# EAGLE schematic classicVtwin (EAGLE 6.3)
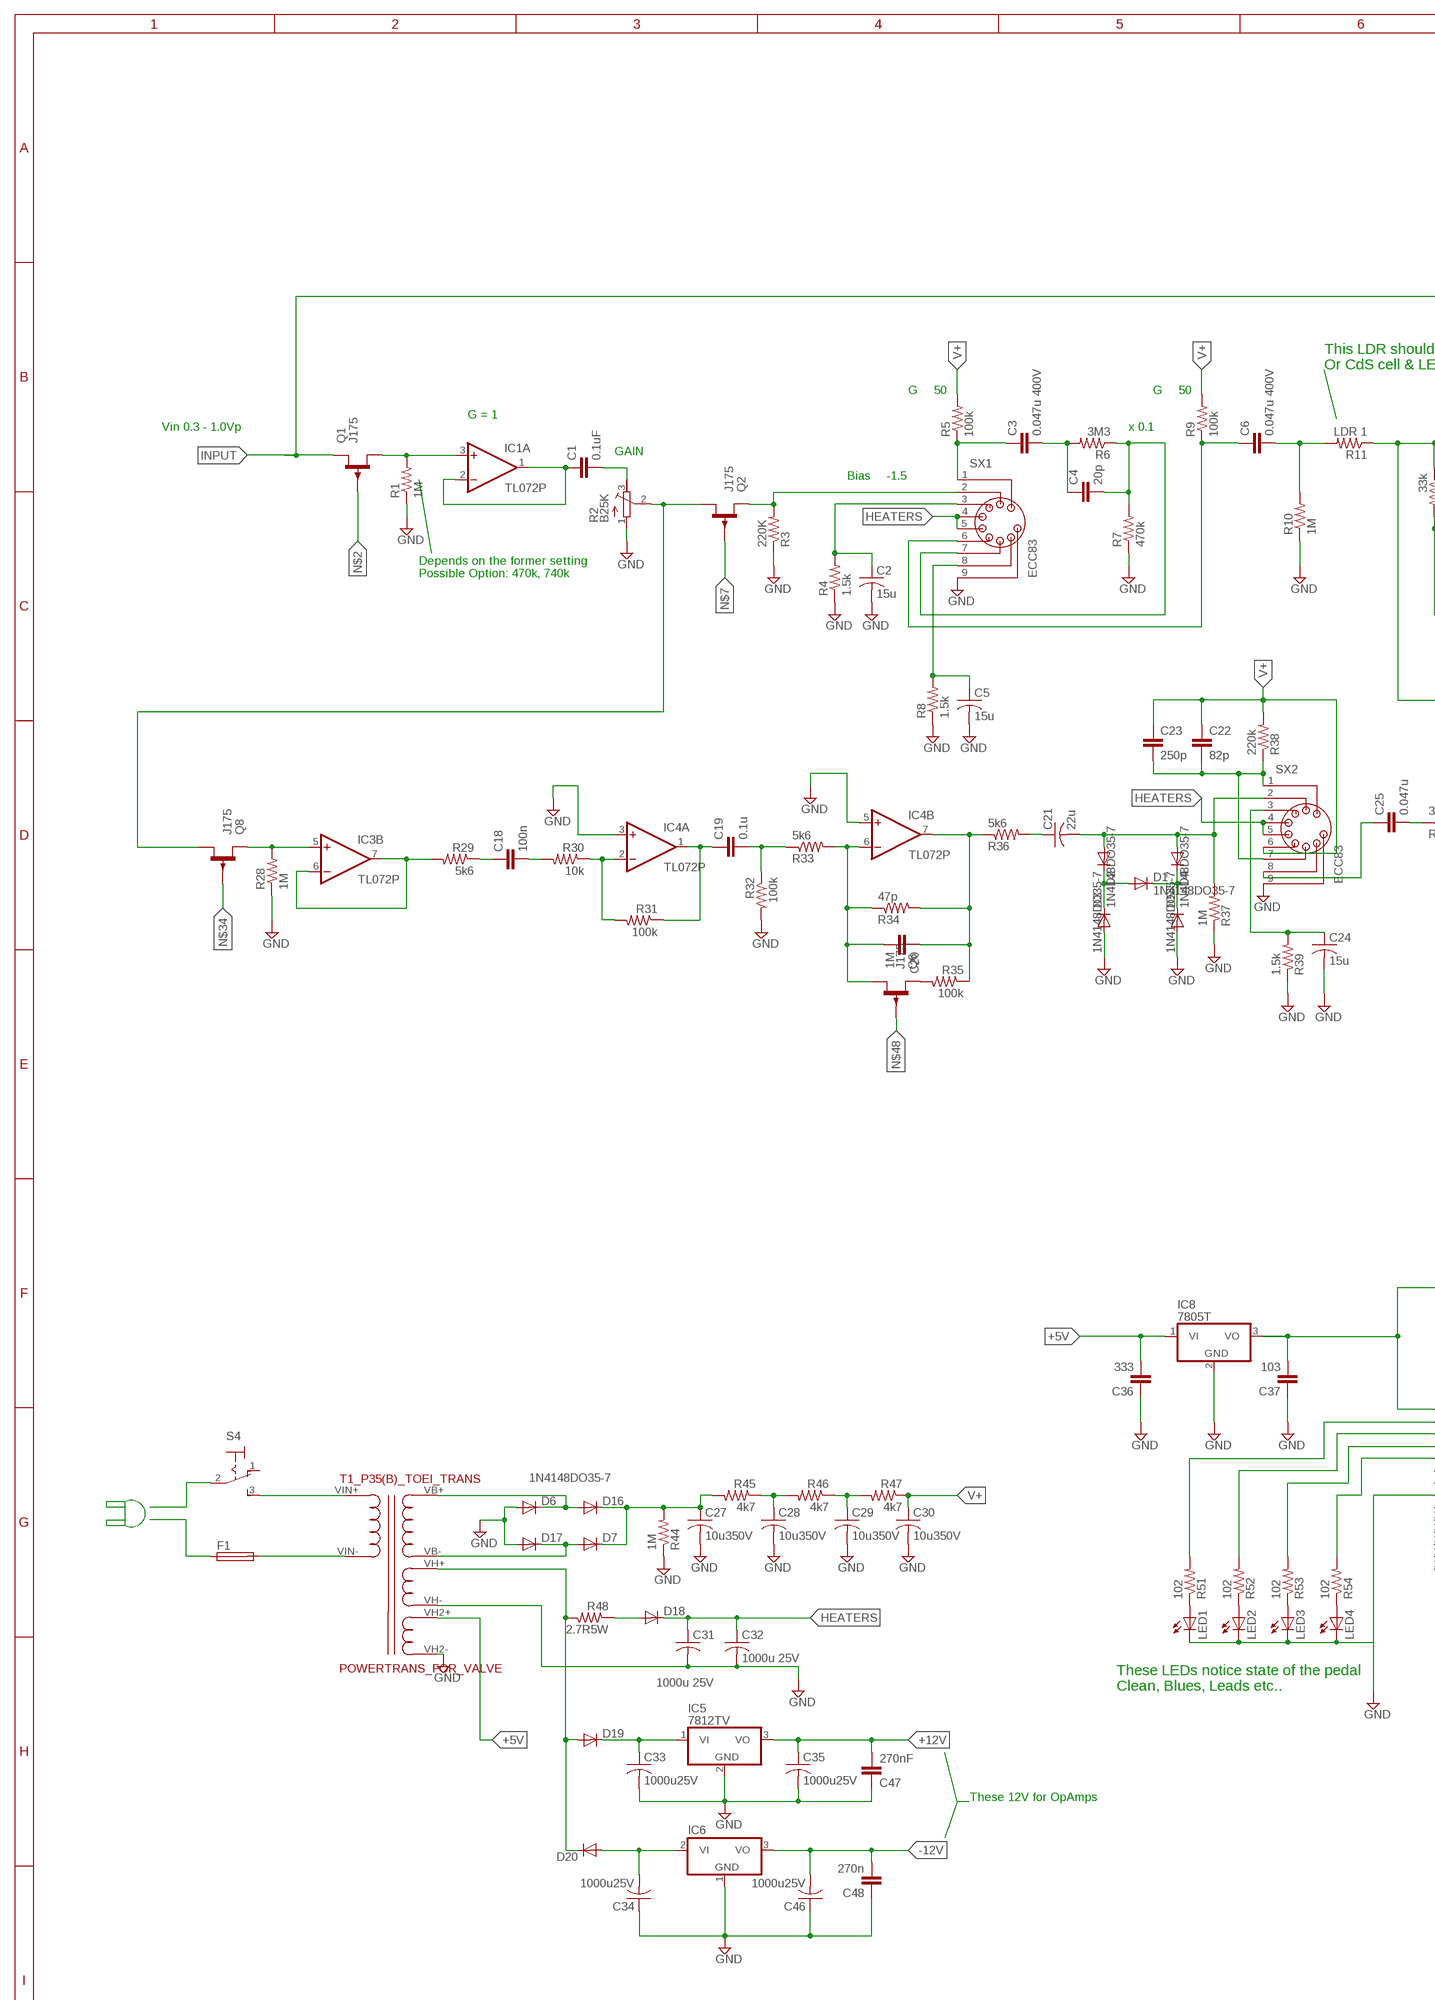
[diagram p0: schematic, sheet 1, part 1 of 2]
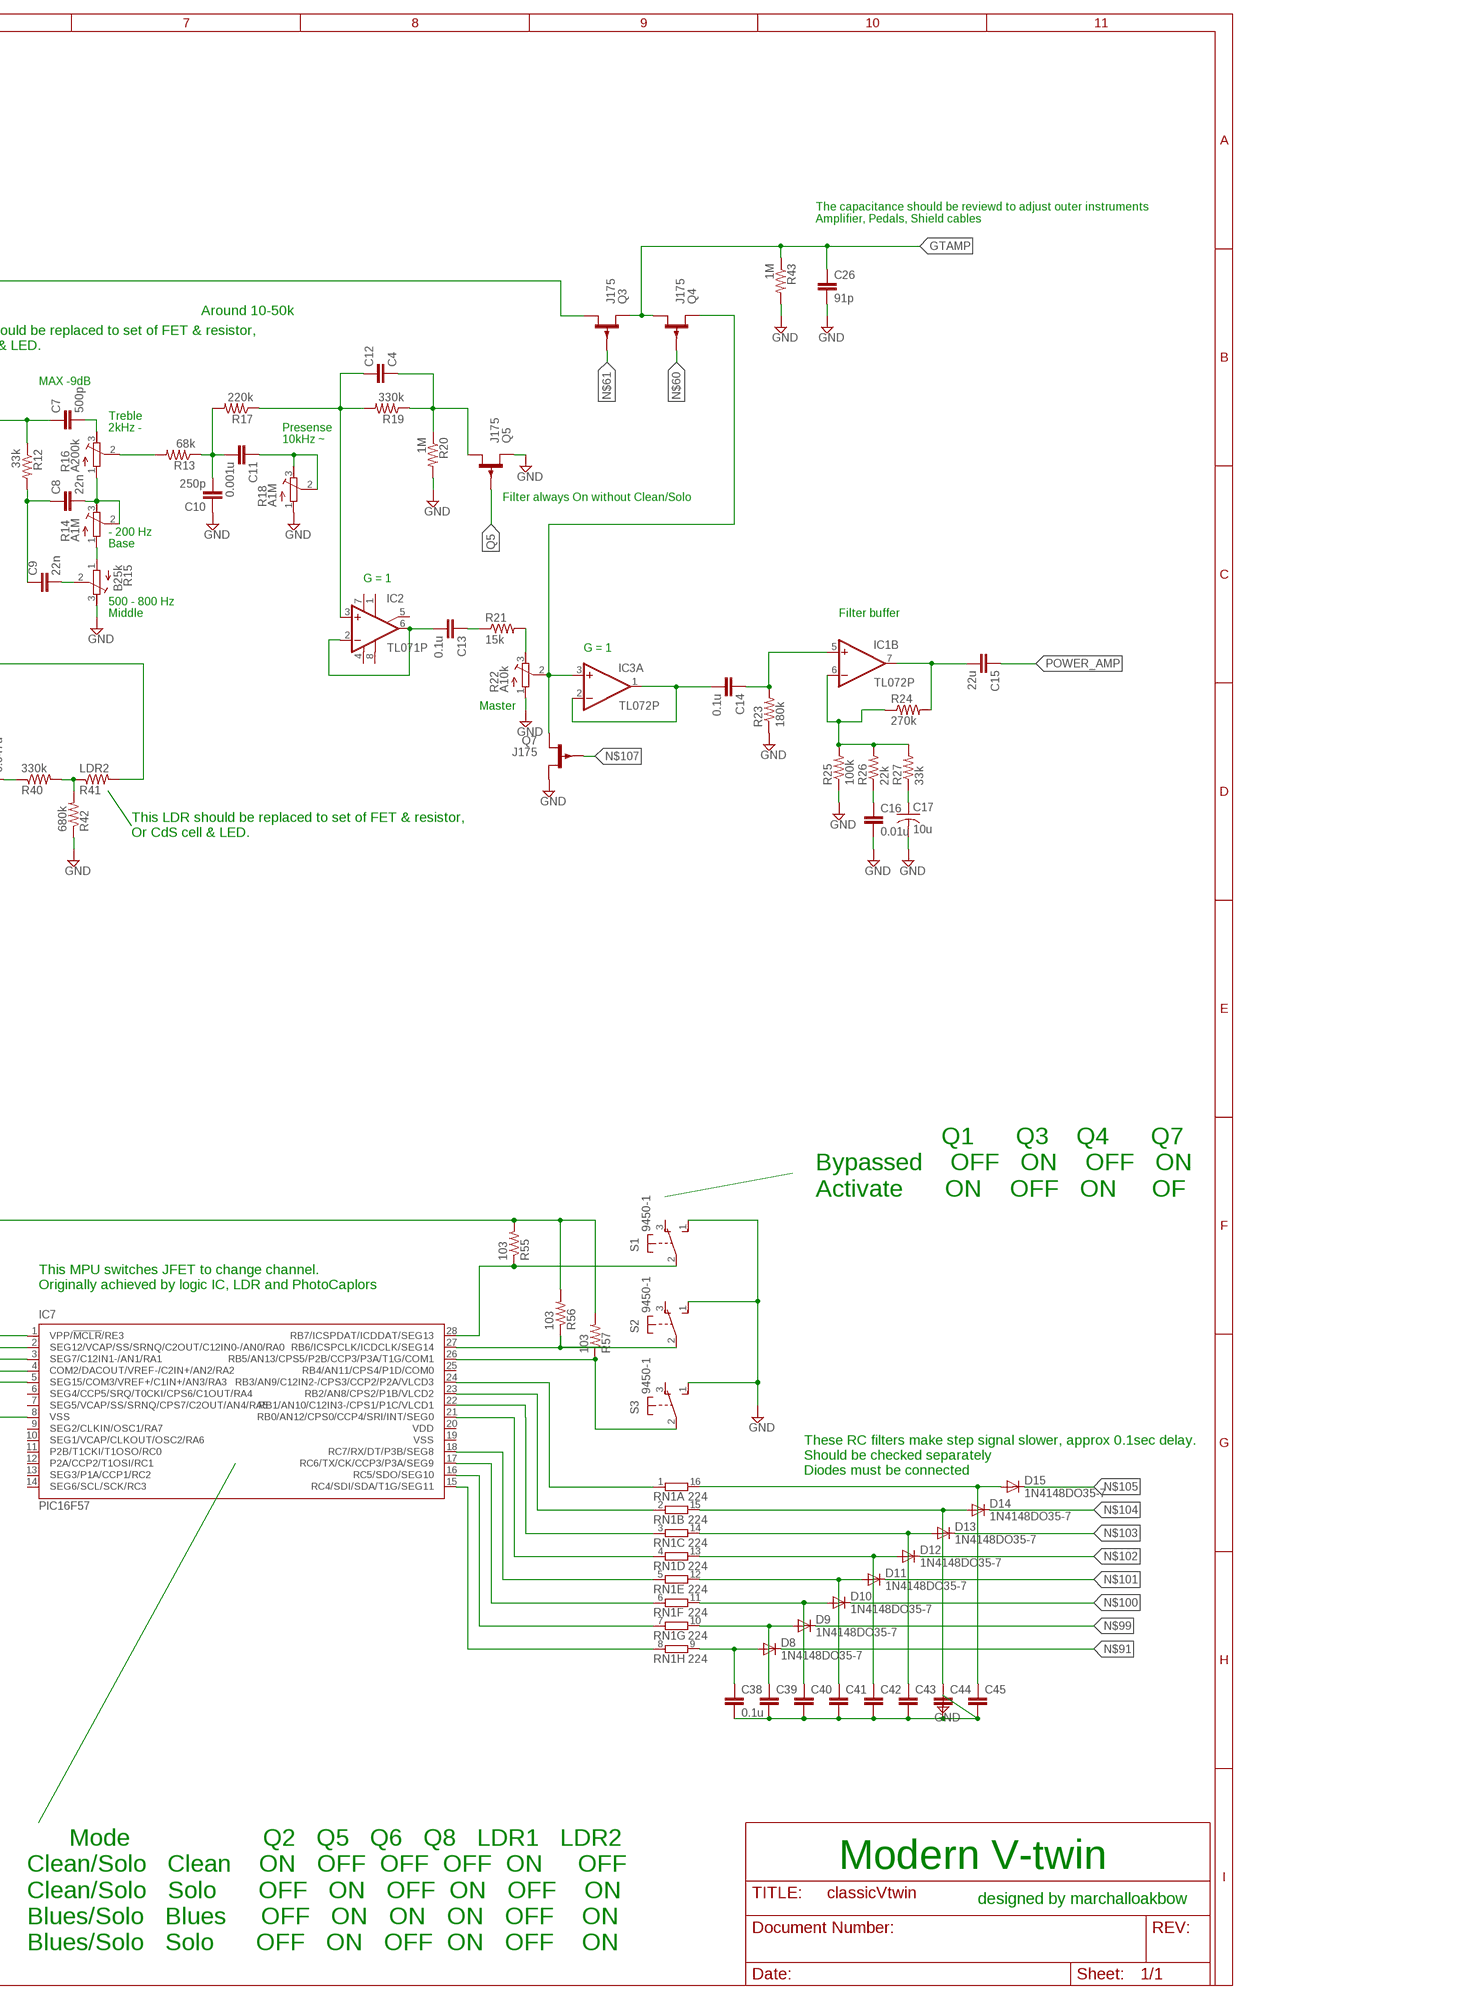
[diagram p1: schematic, sheet 1, part 2 of 2]

## Parts
C1  0.1uF  C5/3  [C5B3]
C2  15u  C-US025-025X050  [C025-025X050]
C3  0.047u 400V  C5/3  [C5B3]
C4  20p  C5/3  [C5B3]
C5  15u  C-US025-025X050  [C025-025X050]
C6  0.047u 400V  C5/3  [C5B3]
C7  500p  C5/3  [C5B3]
C8  22n  C5/3  [C5B3]
C9  22n  C5/3  [C5B3]
C10  250p  C5/3  [C5B3]
C11  0.001u  C5/3  [C5B3]
C12  C4  C5/3  [C5B3]
C13  0.1u  C5/3  [C5B3]
C14  0.1u  C5/3  [C5B3]
C15  22u  C5/3  [C5B3]
C16  0.01u  C5/3  [C5B3]
C17  10u  C-US025-025X050  [C025-025X050]
C18  100n  C5/3  [C5B3]
C19  0.1u  C5/3  [C5B3]
C20  1M  C5/3  [C5B3]
C21  22u  C-US025-025X050  [C025-025X050]
C22  82p  C5/3  [C5B3]
C23  250p  C5/3  [C5B3]
C24  15u  C-US025-025X050  [C025-025X050]
C25  0.047u  C5/3  [C5B3]
C26  91p  C5/3  [C5B3]
C27  10u350V  C-US025-025X050  [C025-025X050]
C28  10u350V  C-US025-025X050  [C025-025X050]
C29  10u350V  C-US025-025X050  [C025-025X050]
C30  10u350V  C-US025-025X050  [C025-025X050]
C31  1000u 25V  C-US025-025X050  [C025-025X050]
C32  1000u 25V  C-US025-025X050  [C025-025X050]
C33  1000u25V  C-US025-025X050  [C025-025X050]
C34  1000u25V  C-US025-025X050  [C025-025X050]
C35  1000u25V  C-US025-025X050  [C025-025X050]
C36  333  C5/3  [C5B3]
C37  103  C5/3  [C5B3]
C38  0.1u  C-EU025-024X044  [C025-024X044]
C39  C-EU025-024X044  [C025-024X044]
C40  C-EU025-024X044  [C025-024X044]
C41  C-EU025-024X044  [C025-024X044]
C42  C-EU025-024X044  [C025-024X044]
C43  C-EU025-024X044  [C025-024X044]
C44  C-EU025-024X044  [C025-024X044]
C45  C-EU025-024X044  [C025-024X044]
C46  1000u25V  C-US025-025X050  [C025-025X050]
C47  270nF  C5/3  [C5B3]
C48  270n  C5/3  [C5B3]
D1  1N4148DO35-7  [DO35-7]
D2  1N4148DO35-7  [DO35-7]
D3  1N4148DO35-7  [DO35-7]
D4  1N4148DO35-7  [DO35-7]
D5  1N4148DO35-7  [DO35-7]
D6  1N4148DO35-7  [DO35-7]
D7  1N4148DO35-7  [DO35-7]
D8  1N4148DO35-7  [DO35-7]
D9  1N4148DO35-7  [DO35-7]
D10  1N4148DO35-7  [DO35-7]
D11  1N4148DO35-7  [DO35-7]
D12  1N4148DO35-7  [DO35-7]
D13  1N4148DO35-7  [DO35-7]
D14  1N4148DO35-7  [DO35-7]
D15  1N4148DO35-7  [DO35-7]
D16  1N4148DO35-7  [DO35-7]
D17  1N4148DO35-7  [DO35-7]
D18  1N4148DO35-7  [DO35-7]
D19  1N4148DO35-7  [DO35-7]
D20  1N4148DO35-7  [DO35-7]
F1  SH22,5  [SH22,5]
IC1  TL072P  [DIL08]
IC2  TL071P  [DIL08]
IC3  TL072P  [DIL08]
IC4  TL072P  [DIL08]
IC5  7812TV  [TO220V]
IC6  7912T  [TO220H]
IC7  PIC16F57  PIC16F1933SP  [DIL28-3]
IC8  7805T  [TO220H]
LED1  LED5MM  [LED5MM]
LED2  LED5MM  [LED5MM]
LED3  LED5MM  [LED5MM]
LED4  LED5MM  [LED5MM]
Q1  J175  2N3820  [TO92F]
Q2  J175  2N3820  [TO92F]
Q3  J175  2N3820  [TO92F]
Q4  J175  2N3820  [TO92F]
Q5  J175  2N3820  [TO92F]
Q6  J175  2N3820  [TO92F]
Q7  J175  2N3820  [TO92F]
Q8  J175  2N3820  [TO92F]
R1  1M  R-US_0204/2V  [0204V]
R2  B25K  R-TRIMM64W  [RTRIM64W]
R3  220K  R-US_0204/2V  [0204V]
R4  1.5k  R-US_0204/2V  [0204V]
R5  100k  R-US_0204/2V  [0204V]
R6  3M3  R-US_0204/2V  [0204V]
R7  470k  R-US_0204/2V  [0204V]
R8  1.5k  R-US_0204/2V  [0204V]
R9  100k  R-US_0204/2V  [0204V]
R10  1M  R-US_0204/2V  [0204V]
R11  LDR 1  R-US_0204/2V  [0204V]
R12  33k  R-US_0204/2V  [0204V]
R13  68k  R-US_0204/2V  [0204V]
R14  A1M  R-TRIMM64W  [RTRIM64W]
R15  B25k  R-TRIMM64W  [RTRIM64W]
R16  A200k  R-TRIMM64W  [RTRIM64W]
R17  220k  R-US_0204/2V  [0204V]
R18  A1M  R-TRIMM64W  [RTRIM64W]
R19  330k  R-US_0204/2V  [0204V]
R20  1M  R-US_0204/2V  [0204V]
R21  15k  R-US_0204/2V  [0204V]
R22  A10k  R-TRIMM64W  [RTRIM64W]
R23  180k  R-US_0204/2V  [0204V]
R24  270k  R-US_0204/2V  [0204V]
R25  100k  R-US_0204/2V  [0204V]
R26  22k  R-US_0204/2V  [0204V]
R27  33k  R-US_0204/2V  [0204V]
R28  1M  R-US_0204/2V  [0204V]
R29  5k6  R-US_0204/2V  [0204V]
R30  10k  R-US_0204/2V  [0204V]
R31  100k  R-US_0204/2V  [0204V]
R32  100k  R-US_0204/2V  [0204V]
R33  5k6  R-US_0204/2V  [0204V]
R34  47p  R-US_0204/2V  [0204V]
R35  100k  R-US_0204/2V  [0204V]
R36  5k6  R-US_0204/2V  [0204V]
R37  1M  R-US_0204/2V  [0204V]
R38  220k  R-US_0204/2V  [0204V]
R39  1.5k  R-US_0204/2V  [0204V]
R40  330k  R-US_0204/2V  [0204V]
R41  LDR2  R-US_0204/2V  [0204V]
R42  680k  R-US_0204/2V  [0204V]
R43  1M  R-US_0204/2V  [0204V]
R44  1M  R-US_0204/2V  [0204V]
R45  4k7  R-US_0204/2V  [0204V]
R46  4k7  R-US_0204/2V  [0204V]
R47  4k7  R-US_0204/2V  [0204V]
R48  2.7R5W  R-US_0204/2V  [0204V]
R51  102  R-US_0204/2V  [0204V]
R52  102  R-US_0204/2V  [0204V]
R53  102  R-US_0204/2V  [0204V]
R54  102  R-US_0204/2V  [0204V]
R55  103  R-US_0204/2V  [0204V]
R56  103  R-US_0204/2V  [0204V]
R57  103  R-US_0204/2V  [0204V]
RN1  224  8R-N  [DIL16]
S1  9450-1  [9450-1]
S2  9450-1  [9450-1]
S3  9450-1  [9450-1]
S4  M9040P  [M9040P]
SX1  ECC83  VT9-PT  [VT9-PT]
SX2  ECC83  VT9-PT  [VT9-PT]
T1_P35(B)_TOEI_TRANS  POWERTRANS_FOR_VALVE  [POWERTRANS]

## Nets
+5V: C36.2 IC8.1(VI) T1_P35(B)_TOEI_TRANS.VH2+
+12V: C35.1 C47.2 IC5.3(VO)
-12V: C46.2 C48.2 IC6.3(VO)
GND: C2.2 C5.2 C10.1 C16.2 C17.2 C24.2 C26.2 C27.2 C28.2 C29.2 C30.2 C31.2 C32.2 C33.2 C34.1 C35.2 C36.1 C37.1 C38.2 C39.2 C40.2 C41.2 C42.2 C43.2 C44.2 C45.2 C46.1 C47.1 C48.1 D3.A D5.A D6.A D17.A IC4.3(A:+IN) IC4.5(B:+IN) IC5.2(GND) IC6.1(GND) IC7.8(VSS) IC8.2(GND) LED1.K(C) LED2.K(C) LED3.K(C) LED4.K(C) Q5.S Q7.D R1.1 R2.1(E) R3.1 R4.1 R7.1 R8.1 R10.1 R15.3(A) R18.1(E) R20.2 R22.1(E) R23.1 R25.1 R28.1 R32.2 R37.1 R39.1 R42.1 R43.2 R44.1 S1.1(S) S2.1(S) S3.1(S) SX1.9 SX2.9 T1_P35(B)_TOEI_TRANS.VH2- T1_P35(B)_TOEI_TRANS.VH-
GTAMP: C26.1 Q3.S Q4.D R43.1
HEATERS: C31.1 C32.1 D18.C SX1.4 SX1.5 SX2.4 SX2.5
INPUT: Q1.S Q3.D
N$1: IC1.3(A:+IN) Q1.D R1.2
N$2: Q1.G
N$3: C1.1 IC1.1(A:OUT) IC1.2(A:-IN)
N$4: C1.2 R2.3(A)
N$5: Q2.D Q8.D R2.2(S)
N$6: Q2.S R3.2 SX1.2
N$7: Q2.G
N$8: C2.1 R4.2 SX1.3
N$9: C3.1 R5.1 SX1.1
N$10: C3.2 C4.1 R6.2
N$11: C4.2 R6.1 R7.2 SX1.7
N$12: R13.2 R16.2(S)
N$13: C5.1 R8.2 SX1.8
N$14: C6.1 R9.1 SX1.6
N$15: C6.2 R10.2 R11.2
N$16: C10.2 C11.2 R13.1 R17.2
N$17: C7.1 R11.1 R12.1 R41.2
N$18: C8.1 C9.1 R12.2
N$19: C9.2 R15.2(S)
N$20: C8.2 R14.2(S) R14.3(A) R16.1(E)
N$21: C7.2 R16.3(A)
N$22: R14.1(E) R15.1(E)
N$23: C11.1 R18.2(S) R18.3(A)
N$24: C12.1 IC2.3(+IN) R17.1 R19.2
N$25: C12.2 Q5.D R19.1 R20.1
N$26: IC3.5(B:+IN) Q8.S R28.2
N$27: C13.2 IC2.2(-IN) IC2.6(OUT)
N$29: C13.1 R21.1
N$30: R21.2 R22.3(A)
N$31: IC3.3(A:+IN) Q4.S Q7.S R22.2(S)
N$32: C14.2 IC3.1(A:OUT) IC3.2(A:-IN)
N$33: C14.1 IC1.5(B:+IN) R23.2
N$34: Q8.G
N$35: IC1.6(B:-IN) R24.1 R25.2 R26.2 R27.2
N$36: C15.2 IC1.7(B:OUT) R24.2
N$37: C16.1 R26.1
N$38: C17.1 R27.1
N$39: IC3.6(B:-IN) IC3.7(B:OUT) R29.2
N$40: C18.1 R29.1
N$41: C18.2 R30.2
N$42: IC4.2(A:-IN) R30.1 R31.2
N$43: C20.2 IC4.6(B:-IN) Q6.D R33.2 R34.1
N$44: C19.2 R32.1 R33.1
N$45: C19.1 IC4.1(A:OUT) R31.1
N$46: Q6.S R35.2
N$47: C20.1 IC4.7(B:OUT) R34.2 R35.1 R36.1
N$48: Q6.G
N$49: C21.1 R36.2
N$50: C21.2 D2.A D4.A R37.2 SX2.2
N$51: D1.A D2.C D3.C
N$52: D1.C D4.C D5.C
N$53: C22.2 C23.2 R38.1 SX2.1 SX2.7
N$54: C25.2 R40.1
N$55: R40.2 R41.1 R42.2
N$56: C24.1 R39.2 SX2.3
N$57: C25.1 SX2.8
N$58: C37.2 IC7.1(VPP/!MCLR!/RE3) IC8.3(VO) R55.2 R56.2 R57.2
N$59: S4.3(S) T1_P35(B)_TOEI_TRANS.VIN+(100VIN+)
N$60: Q4.G
N$62: F1.2 T1_P35(B)_TOEI_TRANS.VIN-(100VIN-)
N$63: F1.1
N$64: S4.2(P)
N$65: D6.C D16.A T1_P35(B)_TOEI_TRANS.VB+
N$66: D19.A D20.C R48.2 T1_P35(B)_TOEI_TRANS.VH+
N$67: C27.1 D7.C D16.C R44.2 R45.2
N$68: C28.1 R45.1 R46.2
N$69: IC7.15(RC4/SDI/SDA/T1G/SEG11) RN1.8
N$70: C29.1 R46.1 R47.2
N$71: D18.A R48.1
N$72: IC7.16(RC5/SDO/SEG10) RN1.7
N$73: IC7.17(RC6/TX/CK/CCP3/P3A/SEG9) RN1.6
N$74: IC7.18(RC7/RX/DT/P3B/SEG8) RN1.5
N$75: IC7.21(RB0/AN12/CPS0/CCP4/SRI/INT/SEG0) RN1.4
N$76: IC7.22(RB1/AN10/C12IN3-/CPS1/P1C/VLCD1) RN1.3
N$77: IC7.23(RB2/AN8/CPS2/P1B/VLCD2) RN1.2
N$78: IC7.24(RB3/AN9/C12IN2-/CPS3/CCP2/P2A/VLCD3) RN1.1
N$79: IC7.28(RB7/ICSPDAT/ICDDAT/SEG13) R55.1 S1.2(P)
N$81: IC7.26(RB5/AN13/CPS5/P2B/CCP3/P3A/T1G/COM1) R57.1 S3.2(P)
N$82: LED1.A R51.1
N$83: LED2.A R52.1
N$84: LED3.A R53.1
N$85: LED4.A R54.1
N$86: IC7.2(SEG12/VCAP/SS/SRNQ/C2OUT/C12IN0-/AN0/RA0) R51.2
N$87: IC7.3(SEG7/C12IN1-/AN1/RA1) R52.2
N$88: IC7.4(COM2/DACOUT/VREF-/C2IN+/AN2/RA2) R53.2
N$89: IC7.5(SEG15/COM3/VREF+/C1IN+/AN3/RA3) R54.2
N$90: C38.1 D8.A RN1.9
N$91: D8.C
N$92: C39.1 D9.A RN1.10
N$93: C40.1 D10.A RN1.11
N$94: C41.1 D11.A RN1.12
N$95: C42.1 D12.A RN1.13
N$96: C43.1 D13.A RN1.14
N$97: C44.1 D14.A RN1.15
N$98: C45.1 D15.A RN1.16
N$99: D9.C
N$100: D10.C
N$101: D11.C
N$102: D12.C
N$103: D13.C
N$104: D14.C
N$105: D15.C
N$106: IC7.27(RB6/ICSPCLK/ICDCLK/SEG14) R56.1 S2.2(P)
N$107: Q7.G
N$111: D7.A D17.C T1_P35(B)_TOEI_TRANS.VB-
N$113: C33.1 D19.C IC5.1(VI)
N$116: C34.2 D20.A IC6.2(VI)
POWER_AMP: C15.1
Q5: Q5.G
V+: C22.1 C23.1 C30.1 R5.2 R9.2 R38.2 R47.1 SX2.6
Unconnected: IC2.1(ON1) IC2.5(ON2) IC2.8(OPT) IC7.6(SEG4/CCP5/SRQ/T0CKI/CPS6/C1OUT/RA4) IC7.7(SEG5/VCAP/SS/SRNQ/CPS7/C2OUT/AN4/RA5) IC7.9(SEG2/CLKIN/OSC1/RA7) IC7.10(SEG1/VCAP/CLKOUT/OSC2/RA6) IC7.11(P2B/T1CKI/T1OSO/RC0) IC7.12(P2A/CCP2/T1OSI/RC1) IC7.13(SEG3/P1A/CCP1/RC2) IC7.14(SEG6/SCL/SCK/RC3) IC7.25(RB4/AN11/CPS4/P1D/COM0) Q3.G S1.3(O) S2.3(O) S3.3(O) S4.1(O)

## Notes on the sheet
- The capacitance should be reviewd to adjust outer instruments
  Amplifier, Pedals, Shield cables
- Around 10-50k
- This LDR should be replaced to set of FET & resistor,
  Or CdS cell & LED.
- G ≒ 50 | G ≒ 50
- MAX -9dB
- G = 1
- Vin 0.3 - 1.0Vp | x 0.1
- Treble
- GAIN | 2kHz - | Presense
- 10kHz ~
- Bias ≒ -1.5
- Filter always On without Clean/Solo
- - 200 Hz
- Depends on the former setting
  Possible Option: 470k, 740k
- Base
- G = 1
- 500 - 800 Hz
- Middle | Filter buffer
- G = 1
- Master
- This LDR should be replaced to set of FET & resistor,
  Or CdS cell & LED.
- Q1      Q3    Q4      Q7     
  Bypassed    OFF   ON    OFF   ON
  Activate      ON    OFF   ON     OF
- This MPU switches JFET to change channel.
  Originally achieved by logic IC, LDR and PhotoCaplors
- These RC filters make step signal slower, approx 0.1sec delay.
  Should be checked separately
  Diodes must be connected
- These LEDs notice state of the pedal
  Clean, Blues, Leads etc..
- These 12V for OpAmps
- Modern V-twin
- designed by marchalloakbow
- Mode                   Q2   Q5   Q6   Q8   LDR1   LDR2
  Clean/Solo   Clean    ON   OFF  OFF  OFF  ON     OFF
  Clean/Solo   Solo      OFF   ON   OFF  ON   OFF    ON
  Blues/Solo   Blues     OFF   ON   ON   ON   OFF    ON
  Blues/Solo   Solo      OFF   ON   OFF  ON   OFF    ON

## Power pins joined to a net without a drawn wire
V+: IC1.8(P:V+) IC2.7(V+) IC3.8(P:V+) IC4.8(P:V+)
V-: IC1.4(P:V-) IC2.4(V-) IC3.4(P:V-) IC4.4(P:V-)
VDD: IC7.20(VDD)
VSS: IC7.19(VSS)

## Library data of the parts
C1 C3 C4 C6-C16 C18-C20 C22 C23 C25 C26 C36 C37 C47 C48 = capacitor-wima:C: CAPACITOR naming: grid - package width
C2 C5 C17 C21 C24 C27-C35 C46 = rcl:C-US: CAPACITOR, American symbol
C38-C45 = resistor:C-EU: CAPACITOR, European symbol
D1-D20 = diode:1N4148: DIODE high speed (Philips)
F1 = fuse:SH22,5: FUSE HOLDER grid 22,5 mm, OGN0031 8201, Schurter (Buerklin); MF: SCHURTER; MPN: 0031.8201; OC_FARNELL: 1162740; OC_NEWARK: 96F8317
IC1 IC3 IC4 = linear:TL072: OP AMP
IC2 = linear:TL071: OP AMP
IC5 IC8 = linear:78*: Positive VOLTAGE REGULATOR Source: http://cache.national.com/ds/LM/LM78L05.pdf http://www.fairchildsemi.com/ds/LM/LM7805.pdf
IC6 = linear:79*: Negative VOLTAGE REGULATOR
IC7 = microchip:PIC16F19*: Flash-Based, 8-Bit CMOS Microcontrollers wtih LCD Driver and nanoWatt XLP Technology Auto generated by make-symbol-device-package-bsdl.ulp Rev. 33 Source: http://ww1.microchip.com/downloads/en/DeviceDoc/41364D.pdf; MPN: PIC16F1933-I/SP; OC_FARNELL: 1755814; OC_NEWARK: 08R1938
LED1-LED4 = led:LED: LED OSRAM: - CHIPLED LG R971, LG N971, LY N971, LG Q971, LY Q971, LO R971, LY R971 LH N974, LH R974 LS Q976, LO Q976, LY Q976 LO Q996 - Hyper CHIPLED LW Q18S LB Q993, LB Q99A, LB R99A - SideLED LS A670, LO A670, LY A670, LG A670, LP A670 LB A673, LV A673, LT A673, LW A673 LH A674 LY A675 LS A676, LA A676, LO A676, LY A676, LW A676 LS A679, LY A679, LG A679 - Hyper Micro SIDELED® LS Y876, LA Y876, LO Y876, LY Y876 LT Y87S - SmartLED LW L88C, LW L88S LB L89C, LB L89S, LG L890 LS L89K, LO L89K, LY L89K LS L896, LA L896, LO L896, LY L896 - TOPLED LS T670, LO T670, LY T670, LG T670, LP T670 LSG T670, LSP T670, LSY T670, LOP T670, LYG T670 LG T671, LOG T671, LSG T671 LB T673, LV T673, LT T673, LW T673 LH T674 LS T676, LA T676, LO T676, LY T676, LB T676, LH T676, LSB T676, LW T676 LB T67C, LV T67C, LT T67C, LS T67K, LO T67K, LY T67K, LW E67C LS E67B, LA E67B, LO E67B, LY E67B, LB E67C, LV E67C, LT E67C LW T67C LS T679, LY T679, LG T679 LS T770, LO T770, LY T770, LG T770, LP T770 LB T773, LV T773, LT T773, LW T773 LH T774 LS E675, LA E675, LY E675, LS T675 LS T776, LA T776, LO T776, LY T776, LB T776 LHGB T686 LT T68C, LB T68C - Hyper Mini TOPLED® LB M676 - Mini TOPLED Santana® LG M470 LS M47K, LO M47K, LY M47K Source: http://www.osram.convergy.de LUXEON: - LUMILED® LXK2-PW12-R00, LXK2-PW12-S00, LXK2-PW14-U00, LXK2-PW14-V00 LXK2-PM12-R00, LXK2-PM12-S00, LXK2-PM14-U00 LXK2-PE12-Q00, LXK2-PE12-R00, LXK2-PE12-S00, LXK2-PE14-T00, LXK2-PE14-U00 LXK2-PB12-K00, LXK2-PB12-L00, LXK2-PB12-M00, LXK2-PB14-N00, LXK2-PB14-P00, LXK2-PB14-Q00 LXK2-PR12-L00, LXK2-PR12-M00, LXK2-PR14-Q00, LXK2-PR14-R00 LXK2-PD12-Q00, LXK2-PD12-R00, LXK2-PD12-S00 LXK2-PH12-R00, LXK2-PH12-S00 LXK2-PL12-P00, LXK2-PL12-Q00, LXK2-PL12-R00 Source: www.luxeon.com KINGBRIGHT: KA-3528ASYC Source: www.kingbright.com
Q1-Q8 = transistor-small-signal:2N3820: P-CHANNEL FET
R1 R3-R13 R17 R19-R21 R23-R48 R51-R57 = rcl:R-US_: RESISTOR, American symbol
R2 R14-R16 R18 R22 = resistor:R-TRIMM: Trimm resistor
RN1 = resistor-dil:8R-N: DIL RESISTOR; OC_FARNELL: unknown; OC_NEWARK: unknown
S1-S3 = switch-misc:9450-1: MARQUARDT SWITCH
S4 = switch:M9040P: TOGGLE SWITCH Marquardt
SX1 SX2 = belton-engineering:VT9: VACUUM TUBE SOCKET Source: 00004280-VT9-PT.pdf
T1_P35(B)_TOEI_TRANS = transformer-pulse:POWERTRANS_FOR_VALVE